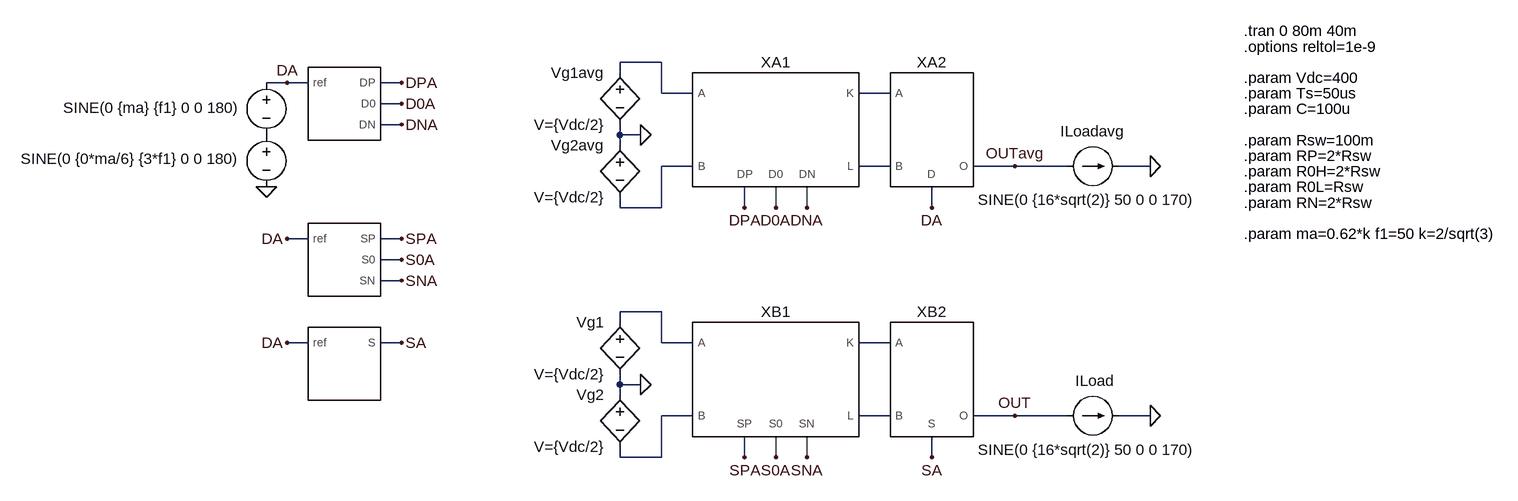
[diagram p0: schematic average_model_validation_4L.asc]
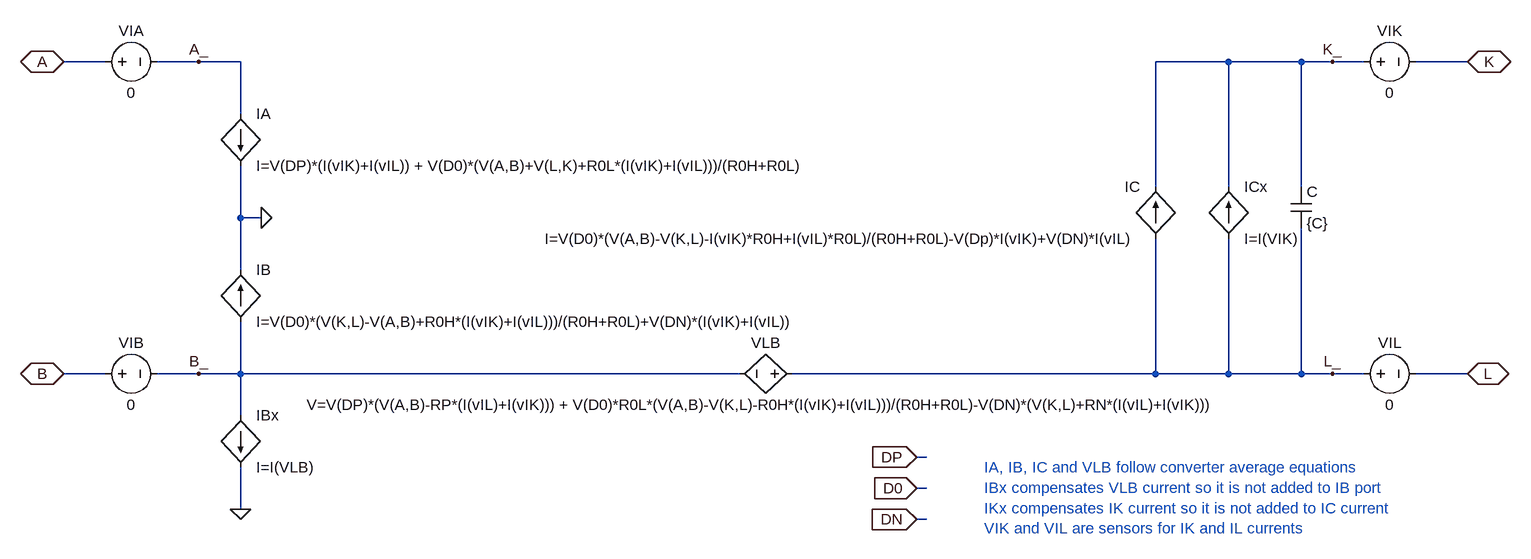
[diagram p1: sub-circuit pn_average_model.asc]
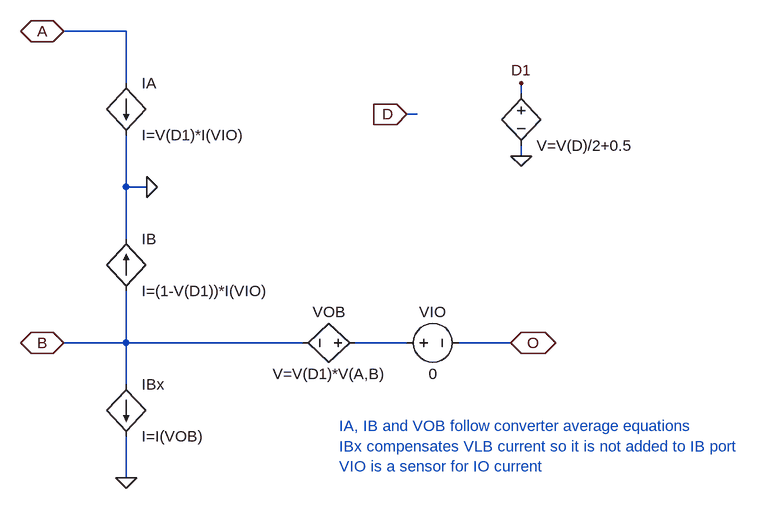
[diagram p2: sub-circuit 2l_average_model.asc]
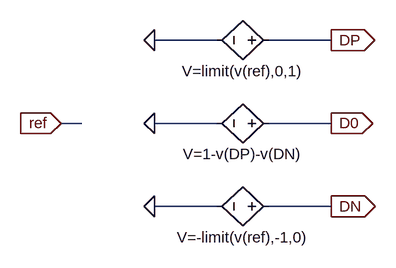
[diagram p3: sub-circuit pn_average_modulator.asc]
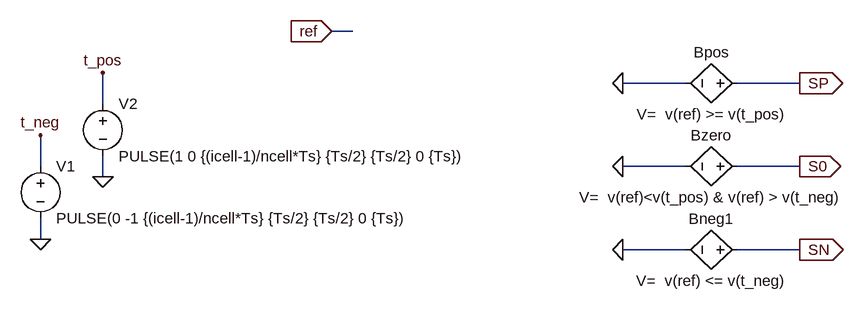
[diagram p4: sub-circuit pn_modulator.asc]
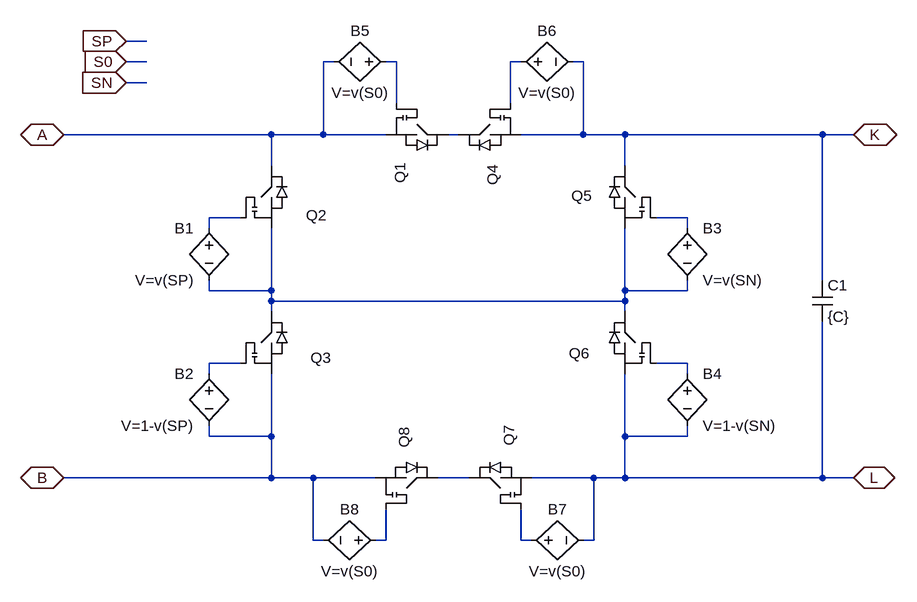
[diagram p5: sub-circuit pn_switching_model.asc]
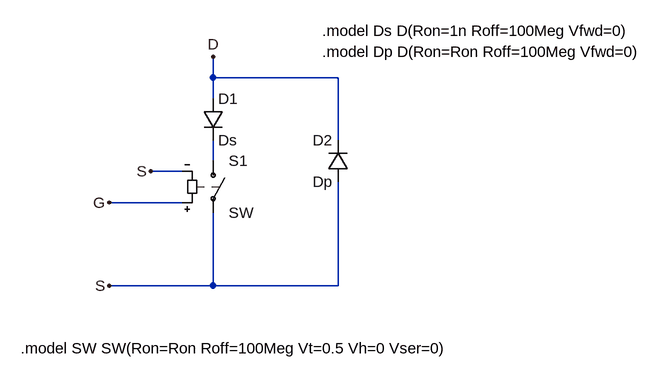
[diagram p6: sub-circuit isw.asc]
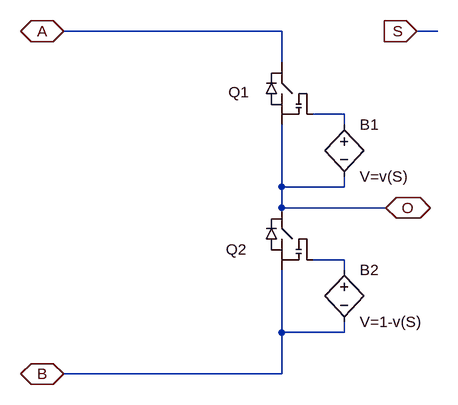
[diagram p7: sub-circuit 2l_switching_model.asc]
average_model_validation_4L.asc, the LTspice schematic file:
Version 4
SHEET 1 4356 1844
WIRE 2224 -1440 2160 -1440
WIRE 2160 -1424 2160 -1440
WIRE 1648 -1408 1616 -1408
WIRE 1680 -1408 1648 -1408
WIRE 1824 -1408 1792 -1408
WIRE 2224 -1392 2224 -1440
WIRE 2272 -1392 2224 -1392
WIRE 2576 -1392 2528 -1392
WIRE 1824 -1376 1792 -1376
WIRE 1824 -1344 1792 -1344
WIRE 2160 -1328 2160 -1344
WIRE 2192 -1328 2160 -1328
WIRE 2160 -1312 2160 -1328
WIRE 2272 -1280 2224 -1280
WIRE 2576 -1280 2528 -1280
WIRE 2768 -1280 2704 -1280
WIRE 2848 -1280 2768 -1280
WIRE 2976 -1280 2928 -1280
WIRE 2160 -1216 2160 -1232
WIRE 2224 -1216 2224 -1280
WIRE 2224 -1216 2160 -1216
WIRE 2352 -1216 2352 -1248
WIRE 2400 -1216 2400 -1248
WIRE 2448 -1216 2448 -1248
WIRE 2640 -1216 2640 -1248
WIRE 1680 -1168 1648 -1168
WIRE 1824 -1168 1792 -1168
WIRE 1824 -1136 1792 -1136
WIRE 1824 -1104 1792 -1104
WIRE 2224 -1056 2160 -1056
WIRE 2160 -1040 2160 -1056
WIRE 1680 -1008 1648 -1008
WIRE 1824 -1008 1792 -1008
WIRE 2224 -1008 2224 -1056
WIRE 2272 -1008 2224 -1008
WIRE 2576 -1008 2528 -1008
WIRE 2160 -944 2160 -960
WIRE 2192 -944 2160 -944
WIRE 2160 -928 2160 -944
WIRE 2272 -896 2224 -896
WIRE 2576 -896 2528 -896
WIRE 2768 -896 2704 -896
WIRE 2848 -896 2768 -896
WIRE 2976 -896 2928 -896
WIRE 2160 -832 2160 -848
WIRE 2224 -832 2224 -896
WIRE 2224 -832 2160 -832
WIRE 2352 -832 2352 -864
WIRE 2400 -832 2400 -864
WIRE 2448 -832 2448 -864
WIRE 2640 -832 2640 -864
FLAG 2976 -896 0
FLAG 1824 -1168 SPA
FLAG 1824 -1136 S0A
FLAG 1824 -1104 SNA
FLAG 2976 -1280 0
FLAG 2352 -1216 DPA
FLAG 2400 -1216 D0A
FLAG 2448 -1216 DNA
FLAG 1824 -1408 DPA
FLAG 1824 -1376 D0A
FLAG 1824 -1344 DNA
FLAG 1616 -1248 0
FLAG 1648 -1408 DA
FLAG 2768 -896 OUT
FLAG 2640 -1216 DA
FLAG 2192 -1328 0
FLAG 1648 -1168 DA
FLAG 2192 -944 0
FLAG 2352 -832 SPA
FLAG 2400 -832 S0A
FLAG 2448 -832 SNA
FLAG 2640 -832 SA
FLAG 2768 -1280 OUTavg
FLAG 1648 -1008 DA
FLAG 1824 -1008 SA
SYMBOL bv 2160 -1440 M0
SYMATTR InstName Vg1avg
SYMATTR Value V={Vdc/2}
SYMBOL PN_average_model 2400 -1344 R0
SYMATTR InstName XA1
SYMATTR SpiceLine C={C} RP={RP} R0H={R0H} R0L={R0L} RN={RN}
SYMBOL voltage 1616 -1424 M0
WINDOW 0 24 16 Invisible 2
WINDOW 3 39 54 Left 2
SYMATTR InstName V1
SYMATTR Value SINE(0 {ma} {f1} 0 0 180)
SYMBOL voltage 1616 -1344 M0
WINDOW 0 24 16 Invisible 2
WINDOW 3 39 53 Left 2
SYMATTR InstName V7
SYMATTR Value SINE(0 {0*ma/6} {3*f1} 0 0 180)
SYMBOL 2L_average_model 2640 -1360 R0
SYMATTR InstName XA2
SYMBOL bv 2160 -1328 M0
SYMATTR InstName Vg2avg
SYMATTR Value V={Vdc/2}
SYMBOL current 2848 -896 M90
WINDOW 123 0 0 Left 2
WINDOW 39 0 0 Left 2
WINDOW 3 52 -137 VRight 2
WINDOW 0 -54 13 VRight 2
SYMATTR Value SINE(0 {16*sqrt(2)} 50 0 0 170)
SYMATTR InstName ILoad
SYMBOL current 2848 -1280 M90
WINDOW 123 0 0 Left 2
WINDOW 39 0 0 Left 2
WINDOW 3 52 -137 VRight 2
WINDOW 0 -54 -10 VRight 2
SYMATTR Value SINE(0 {16*sqrt(2)} 50 0 0 170)
SYMATTR InstName ILoadavg
SYMBOL PN_average_modulator 1728 -1376 R0
WINDOW 0 8 -56 Invisible 2
SYMATTR InstName X2
SYMBOL PN_modulator 1728 -1136 R0
WINDOW 0 8 -56 Invisible 2
SYMATTR InstName X3SP
SYMBOL PN_switching_model 2400 -960 R0
SYMATTR InstName XB1
SYMATTR SpiceLine C=100u Rswitch=Rsw
SYMBOL bv 2160 -1056 M0
SYMATTR InstName Vg1
SYMATTR Value V={Vdc/2}
SYMBOL bv 2160 -944 M0
SYMATTR InstName Vg2
SYMATTR Value V={Vdc/2}
SYMBOL 2L_switching_model 2640 -976 R0
SYMATTR InstName XB2
SYMBOL 2L_modulator 1728 -976 R0
WINDOW 0 8 -56 Invisible 2
SYMATTR InstName X1
TEXT 3120 -1392 Left 2 !.param Ts=50us
TEXT 3120 -1488 Left 2 !.tran 0 80m 40m
TEXT 3120 -1416 Left 2 !.param Vdc=400
TEXT 3120 -1176 Left 2 !.param ma=0.62*k f1=50 k=2/sqrt(3)
TEXT 3120 -1320 Left 2 !.param Rsw=100m
TEXT 3120 -1296 Left 2 !.param RP=2*Rsw
TEXT 3120 -1224 Left 2 !.param RN=2*Rsw
TEXT 3120 -1272 Left 2 !.param R0H=2*Rsw
TEXT 3120 -1248 Left 2 !.param R0L=Rsw
TEXT 3120 -1368 Left 2 !.param C=100u
TEXT 3120 -1464 Left 2 !.options reltol=1e-9

pn_average_model.asc, the sub-circuit schematic file:
Version 4
SHEET 1 2060 780
WIRE -720 16 -784 16
WIRE -576 16 -640 16
WIRE -512 16 -576 16
WIRE 1008 16 896 16
WIRE 1120 16 1008 16
WIRE 1168 16 1120 16
WIRE 1216 16 1168 16
WIRE 1376 16 1296 16
WIRE -512 96 -512 16
WIRE 896 208 896 16
WIRE 1008 208 1008 16
WIRE 1120 208 1120 16
WIRE -512 256 -512 176
WIRE -480 256 -512 256
WIRE -512 336 -512 256
WIRE -720 496 -784 496
WIRE -576 496 -640 496
WIRE -512 496 -512 416
WIRE -512 496 -576 496
WIRE 256 496 -512 496
WIRE 896 496 896 288
WIRE 896 496 336 496
WIRE 1008 496 1008 288
WIRE 1008 496 896 496
WIRE 1120 496 1120 272
WIRE 1120 496 1008 496
WIRE 1168 496 1120 496
WIRE 1216 496 1168 496
WIRE 1376 496 1296 496
WIRE -512 560 -512 496
WIRE 544 624 528 624
WIRE 544 672 528 672
WIRE -512 704 -512 640
WIRE 544 720 528 720
FLAG 1376 16 K
IOPIN 1376 16 BiDir
FLAG 1376 496 L
IOPIN 1376 496 BiDir
FLAG -784 16 A
IOPIN -784 16 BiDir
FLAG -784 496 B
IOPIN -784 496 BiDir
FLAG 528 624 DP
IOPIN 528 624 In
FLAG 528 672 D0
IOPIN 528 672 In
FLAG 528 720 DN
IOPIN 528 720 In
FLAG -480 256 0
FLAG -512 704 0
FLAG -576 16 A_
FLAG -576 496 B_
FLAG 1168 16 K_
FLAG 1168 496 L_
SYMBOL bv 352 496 R90
WINDOW 0 -32 56 VBottom 2
WINDOW 3 32 56 VTop 2
SYMATTR InstName VLB
SYMATTR Value V=V(DP)*(V(A,B)-RP*(I(vIL)+I(vIK))) + V(D0)*R0L*(V(A,B)-V(K,L)-R0H*(I(vIK)+I(vIL)))/(R0H+R0L)-V(DN)*(V(K,L)+RN*(I(vIL)+I(vIK)))
SYMBOL bi -512 96 R0
SYMATTR InstName IA
SYMATTR Value I=V(DP)*(I(vIK)+I(vIL)) + V(D0)*(V(A,B)+V(L,K)+R0L*(I(vIK)+I(vIL)))/(R0H+R0L)
SYMBOL cap 1104 208 R0
SYMATTR InstName C
SYMATTR Value {C}
SYMBOL bi 896 288 R180
WINDOW 0 24 80 Left 2
WINDOW 3 24 0 Left 2
SYMATTR InstName IC
SYMATTR Value I=V(D0)*(V(A,B)-V(K,L)-I(vIK)*R0H+I(vIL)*R0L)/(R0H+R0L)-V(Dp)*I(vIK)+V(DN)*I(vIL)
SYMBOL bi -512 416 M180
WINDOW 0 24 80 Left 2
WINDOW 3 24 0 Left 2
SYMATTR InstName IB
SYMATTR Value I=V(D0)*(V(K,L)-V(A,B)+R0H*(I(vIK)+I(vIL)))/(R0H+R0L)+V(DN)*(I(vIK)+I(vIL))
SYMBOL voltage 1200 496 R270
WINDOW 0 32 56 VTop 2
WINDOW 3 -32 56 VBottom 2
SYMATTR InstName VIL
SYMATTR Value 0
SYMBOL voltage 1200 16 R270
WINDOW 0 32 56 VTop 2
WINDOW 3 -32 56 VBottom 2
SYMATTR InstName VIK
SYMATTR Value 0
SYMBOL bi -512 560 R0
SYMATTR InstName IBx
SYMATTR Value I=I(VLB)
SYMBOL bi 1008 288 M180
WINDOW 0 24 80 Left 2
WINDOW 3 24 0 Left 2
SYMATTR InstName ICx
SYMATTR Value I=I(VIK)
SYMBOL voltage -736 496 R270
WINDOW 0 32 56 VTop 2
WINDOW 3 -32 56 VBottom 2
SYMATTR InstName VIB
SYMATTR Value 0
SYMBOL voltage -736 16 R270
WINDOW 0 32 56 VTop 2
WINDOW 3 -32 56 VBottom 2
SYMATTR InstName VIA
SYMATTR Value 0
TEXT 632 640 Left 2 ;IA, IB, IC and VLB follow converter average equations\nIBx compensates VLB current so it is not added to IB port\nIKx compensates IK current so it is not added to IC current\nVIK and VIL are sensors for IK and IL currents

2l_average_model.asc, the sub-circuit schematic file:
Version 4
SHEET 1 2060 780
WIRE -512 16 -608 16
WIRE -512 96 -512 16
WIRE 96 112 96 96
WIRE -64 144 -80 144
WIRE 96 208 96 192
WIRE -512 256 -512 176
WIRE -480 256 -512 256
WIRE -512 336 -512 256
WIRE -512 496 -512 416
WIRE -512 496 -608 496
WIRE -240 496 -512 496
WIRE -80 496 -160 496
WIRE 80 496 0 496
WIRE -512 560 -512 496
WIRE -512 704 -512 640
FLAG 80 496 O
IOPIN 80 496 BiDir
FLAG -608 16 A
IOPIN -608 16 BiDir
FLAG -608 496 B
IOPIN -608 496 BiDir
FLAG -80 144 D
IOPIN -80 144 In
FLAG -480 256 0
FLAG -512 704 0
FLAG 96 208 0
FLAG 96 96 D1
SYMBOL bv -144 496 R90
WINDOW 0 -32 56 VBottom 2
WINDOW 3 32 56 VTop 2
SYMATTR InstName VOB
SYMATTR Value V=V(D1)*V(A,B)
SYMBOL bi -512 96 R0
SYMATTR InstName IA
SYMATTR Value I=V(D1)*I(VIO)
SYMBOL bi -512 416 M180
WINDOW 0 24 80 Left 2
WINDOW 3 24 0 Left 2
SYMATTR InstName IB
SYMATTR Value I=(1-V(D1))*I(VIO)
SYMBOL voltage -96 496 R270
WINDOW 0 32 56 VTop 2
WINDOW 3 -32 56 VBottom 2
SYMATTR InstName VIO
SYMATTR Value 0
SYMBOL bi -512 560 R0
SYMATTR InstName IBx
SYMATTR Value I=I(VOB)
SYMBOL bv 96 96 R0
WINDOW 0 24 16 Invisible 2
SYMATTR InstName VD
SYMATTR Value V=V(D)/2+0.5
TEXT -184 624 Left 2 ;IA, IB and VOB follow converter average equations\nIBx compensates VLB current so it is not added to IB port\nVIO is a sensor for IO current

pn_average_modulator.asc, the sub-circuit schematic file:
Version 4
SHEET 1 880 680
WIRE 304 160 208 160
WIRE 480 160 384 160
WIRE 96 288 64 288
WIRE 304 288 208 288
WIRE 480 288 384 288
WIRE 304 416 208 416
WIRE 480 416 384 416
FLAG 208 160 0
FLAG 208 288 0
FLAG 208 416 0
FLAG 480 160 DP
IOPIN 480 160 Out
FLAG 480 288 D0
IOPIN 480 288 Out
FLAG 480 416 DN
IOPIN 480 416 Out
FLAG 64 288 ref
IOPIN 64 288 In
SYMBOL bv 400 160 R90
WINDOW 0 -32 56 Invisible 2
WINDOW 3 32 56 VTop 2
SYMATTR InstName Bpos1
SYMATTR Value V=limit(v(ref),0,1)
SYMBOL bv 400 288 R90
WINDOW 0 -32 56 Invisible 2
WINDOW 3 32 56 VTop 2
SYMATTR InstName Bzero1
SYMATTR Value V=1-v(DP)-v(DN)
SYMBOL bv 400 416 R90
WINDOW 0 -32 56 Invisible 2
WINDOW 3 32 56 VTop 2
SYMATTR InstName Bneg1
SYMATTR Value V=-limit(v(ref),-1,0)

pn_modulator.asc, the sub-circuit schematic file:
Version 4
SHEET 1 1100 680
WIRE 304 160 272 160
WIRE 816 240 720 240
WIRE 992 240 896 240
WIRE -80 272 -80 224
WIRE -176 368 -176 320
WIRE 816 368 720 368
WIRE 992 368 896 368
WIRE -80 384 -80 352
WIRE -176 480 -176 448
WIRE 816 496 720 496
WIRE 992 496 896 496
FLAG -176 480 0
FLAG -176 320 t_neg
FLAG -80 384 0
FLAG -80 224 t_pos
FLAG 720 240 0
FLAG 720 368 0
FLAG 720 496 0
FLAG 992 240 SP
IOPIN 992 240 Out
FLAG 992 368 S0
IOPIN 992 368 Out
FLAG 992 496 SN
IOPIN 992 496 Out
FLAG 272 160 ref
IOPIN 272 160 In
SYMBOL voltage -176 352 R0
WINDOW 123 0 0 Left 2
WINDOW 39 0 0 Left 2
SYMATTR InstName V1
SYMATTR Value PULSE(0 -1 {(icell-1)/ncell*Ts} {Ts/2} {Ts/2} 0 {Ts})
SYMBOL voltage -80 256 R0
WINDOW 123 0 0 Left 2
WINDOW 39 0 0 Left 2
SYMATTR InstName V2
SYMATTR Value PULSE(1 0 {(icell-1)/ncell*Ts} {Ts/2} {Ts/2} 0 {Ts})
SYMBOL bv 912 240 R90
WINDOW 0 -32 56 VBottom 2
WINDOW 3 32 56 VTop 2
SYMATTR InstName Bpos
SYMATTR Value V=  v(ref) >= v(t_pos)
SYMBOL bv 912 368 R90
WINDOW 0 -32 56 VBottom 2
WINDOW 3 32 56 VTop 2
SYMATTR InstName Bzero
SYMATTR Value V=  v(ref)<v(t_pos) & v(ref) > v(t_neg)
SYMBOL bv 912 496 R90
WINDOW 0 -32 56 VBottom 2
WINDOW 3 32 56 VTop 2
SYMATTR InstName Bneg1
SYMATTR Value V=  v(ref) <= v(t_neg)

pn_switching_model.asc, the sub-circuit schematic file:
Version 4
SHEET 1 1104 712
WIRE -48 -112 -80 -112
WIRE -48 -80 -80 -80
WIRE 240 -80 224 -80
WIRE 336 -80 320 -80
WIRE 528 -80 512 -80
WIRE 624 -80 608 -80
WIRE -48 -48 -80 -48
WIRE 336 -16 336 -80
WIRE 512 -16 512 -80
WIRE 144 32 -176 32
WIRE 224 32 224 -80
WIRE 224 32 144 32
WIRE 320 32 224 32
WIRE 432 32 416 32
WIRE 624 32 624 -80
WIRE 624 32 528 32
WIRE 688 32 624 32
WIRE 992 32 688 32
WIRE 1040 32 992 32
WIRE 144 80 144 32
WIRE 688 80 688 32
WIRE 96 160 48 160
WIRE 784 160 736 160
WIRE 48 176 48 160
WIRE 784 176 784 160
WIRE 992 256 992 32
WIRE 48 272 48 256
WIRE 144 272 144 176
WIRE 144 272 48 272
WIRE 688 272 688 176
WIRE 784 272 784 256
WIRE 784 272 688 272
WIRE 144 288 144 272
WIRE 688 288 688 272
WIRE 688 288 144 288
WIRE 144 304 144 288
WIRE 688 304 688 288
WIRE 96 384 48 384
WIRE 784 384 736 384
WIRE 48 400 48 384
WIRE 784 400 784 384
WIRE 48 496 48 480
WIRE 144 496 144 400
WIRE 144 496 48 496
WIRE 688 496 688 400
WIRE 784 496 784 480
WIRE 784 496 688 496
WIRE 144 560 144 496
WIRE 144 560 -176 560
WIRE 208 560 144 560
WIRE 304 560 208 560
WIRE 448 560 400 560
WIRE 640 560 544 560
WIRE 688 560 688 496
WIRE 688 560 640 560
WIRE 992 560 992 320
WIRE 992 560 688 560
WIRE 1040 560 992 560
WIRE 208 656 208 560
WIRE 224 656 208 656
WIRE 320 656 320 608
WIRE 320 656 304 656
WIRE 528 656 528 608
WIRE 544 656 528 656
WIRE 640 656 640 560
WIRE 640 656 624 656
FLAG 1040 32 K
IOPIN 1040 32 BiDir
FLAG 1040 560 L
IOPIN 1040 560 BiDir
FLAG -176 32 A
IOPIN -176 32 BiDir
FLAG -176 560 B
IOPIN -176 560 BiDir
FLAG -80 -112 SP
IOPIN -80 -112 In
FLAG -80 -80 S0
IOPIN -80 -80 In
FLAG -80 -48 SN
IOPIN -80 -48 In
SYMBOL bv 48 160 M0
SYMATTR InstName B1
SYMATTR Value V=v(SP)
SYMBOL bv 48 384 M0
SYMATTR InstName B2
SYMATTR Value V=1-v(SP)
SYMBOL bv 784 160 R0
SYMATTR InstName B3
SYMATTR Value V=v(SN)
SYMBOL bv 784 384 R0
SYMATTR InstName B4
SYMATTR Value V=1-v(SN)
SYMBOL bv 336 -80 R90
WINDOW 0 -32 56 VBottom 2
WINDOW 3 32 56 VTop 2
SYMATTR InstName B5
SYMATTR Value V=v(S0)
SYMBOL bv 512 -80 M90
WINDOW 0 -32 56 VBottom 2
WINDOW 3 32 56 VTop 2
SYMATTR InstName B6
SYMATTR Value V=v(S0)
SYMBOL iSW 352 32 R90
WINDOW 0 43 10 Left 2
SYMATTR InstName Q1
SYMATTR SpiceLine Ron=Rswitch
SYMBOL iSW 144 144 R0
WINDOW 0 53 12 Left 2
SYMATTR InstName Q2
SYMATTR SpiceLine Ron=Rswitch
SYMBOL iSW 144 368 R0
WINDOW 0 60 7 Left 2
SYMATTR InstName Q3
SYMATTR SpiceLine Ron=Rswitch
SYMBOL iSW 496 32 M90
WINDOW 0 46 -12 Left 2
SYMATTR InstName Q4
SYMATTR SpiceLine Ron=Rswitch
SYMBOL iSW 688 144 M0
WINDOW 0 50 -18 Left 2
SYMATTR InstName Q5
SYMATTR SpiceLine Ron=Rswitch
SYMBOL iSW 688 368 M0
WINDOW 0 54 0 Left 2
SYMATTR InstName Q6
SYMATTR SpiceLine Ron=Rswitch
SYMBOL cap 976 256 R0
SYMATTR InstName C1
SYMATTR Value {C}
SYMBOL bv 528 656 R270
WINDOW 0 32 56 VTop 2
WINDOW 3 -32 56 VBottom 2
SYMATTR InstName B7
SYMATTR Value V=v(S0)
SYMBOL bv 320 656 M270
WINDOW 0 32 56 VTop 2
WINDOW 3 -32 56 VBottom 2
SYMATTR InstName B8
SYMATTR Value V=v(S0)
SYMBOL iSW 512 560 R270
WINDOW 0 49 -2 Left 2
SYMATTR InstName Q7
SYMATTR SpiceLine Ron=Rswitch
SYMBOL iSW 336 560 M270
WINDOW 0 46 -12 Left 2
SYMATTR InstName Q8
SYMATTR SpiceLine Ron=Rswitch

isw.asc, the sub-circuit schematic file:
Version 4
SHEET 1 880 680
WIRE 160 -32 160 -64
WIRE 352 -32 160 -32
WIRE 160 0 160 -32
WIRE 352 64 352 -32
WIRE 160 96 160 64
WIRE 112 112 64 112
WIRE 112 160 0 160
WIRE 160 288 0 288
WIRE 160 288 160 176
WIRE 352 288 352 128
WIRE 352 288 160 288
FLAG 0 160 G
FLAG 0 288 S
FLAG 160 -64 D
FLAG 64 112 S
SYMBOL sw 160 80 R0
SYMATTR InstName S1
SYMBOL diode 144 0 R0
SYMATTR InstName D1
SYMATTR Value Ds
SYMBOL diode 368 128 R180
WINDOW 0 24 64 Left 2
WINDOW 3 24 0 Left 2
SYMATTR InstName D2
SYMATTR Value Dp
TEXT -136 384 Left 2 !.model SW SW(Ron=Ron Roff=100Meg Vt=0.5 Vh=0 Vser=0)
TEXT 328 -104 Left 2 !.model Ds D(Ron=1n Roff=100Meg Vfwd=0)
TEXT 328 -72 Left 2 !.model Dp D(Ron=Ron Roff=100Meg Vfwd=0)

2l_switching_model.asc, the sub-circuit schematic file:
Version 4
SHEET 1 880 680
WIRE 448 96 112 96
WIRE 688 96 656 96
WIRE 448 144 448 96
WIRE 544 224 496 224
WIRE 544 240 544 224
WIRE 448 336 448 240
WIRE 544 336 544 320
WIRE 544 336 448 336
WIRE 448 368 448 336
WIRE 608 368 448 368
WIRE 544 448 496 448
WIRE 544 464 544 448
WIRE 448 560 448 464
WIRE 544 560 544 544
WIRE 544 560 448 560
WIRE 448 624 448 560
WIRE 448 624 112 624
FLAG 608 368 O
IOPIN 608 368 BiDir
FLAG 112 96 A
IOPIN 112 96 BiDir
FLAG 112 624 B
IOPIN 112 624 BiDir
FLAG 656 96 S
IOPIN 656 96 In
SYMBOL bv 544 224 R0
SYMATTR InstName B1
SYMATTR Value V=v(S)
SYMBOL bv 544 448 R0
SYMATTR InstName B2
SYMATTR Value V=1-v(S)
SYMBOL iSW 448 208 M0
WINDOW 0 50 -18 Left 2
SYMATTR InstName Q1
SYMATTR SpiceLine Ron=Rsw
SYMBOL iSW 448 432 M0
WINDOW 0 54 0 Left 2
SYMATTR InstName Q2
SYMATTR SpiceLine Ron=Rsw

2l_modulator.asc, the sub-circuit schematic file:
Version 4
SHEET 1 880 680
WIRE -96 208 -128 208
WIRE 336 208 240 208
WIRE 512 208 416 208
WIRE 80 336 80 288
WIRE 80 448 80 416
FLAG 80 448 0
FLAG 80 288 t_posneg
FLAG 240 208 0
FLAG 512 208 S
IOPIN 512 208 Out
FLAG -128 208 ref
IOPIN -128 208 In
SYMBOL voltage 80 320 R0
WINDOW 123 0 0 Left 2
WINDOW 39 0 0 Left 2
SYMATTR InstName V1
SYMATTR Value PULSE(1 -1 {0.5*Ts} {Ts/2} {Ts/2} 0 {Ts})
SYMBOL bv 432 208 R90
WINDOW 0 -32 56 VBottom 2
WINDOW 3 32 56 VTop 2
SYMATTR InstName Bpos1
SYMATTR Value V=  v(ref) >= v(t_posneg)

The netlist it stands for:
* average_model_validation_4L.asc
B§Vg1avg N001 0 V={Vdc/2}
XXA1 D0A DNA DPA N001 N003 N002 N004 pn_average_model params: C={C} RP={RP} R0H={R0H} R0L={R0L} RN={RN}
V1 DA P001 SINE(0 {ma} {f1} 0 0 180)
V7 P001 0 SINE(0 {0*ma/6} {3*f1} 0 0 180)
XXA2 DA N002 N004 OUTavg 2l_average_model
B§Vg2avg 0 N003 V={Vdc/2}
ILoad OUT 0 SINE(0 {16*sqrt(2)} 50 0 0 170)
ILoadavg OUTavg 0 SINE(0 {16*sqrt(2)} 50 0 0 170)
XX2 DA D0A DNA DPA pn_average_modulator
XX3SP DA S0A SNA SPA pn_modulator params: Ts = {Ts} iCell=1 nCell=1
XXB1 S0A SNA SPA N005 N007 N006 N008 pn_switching_model params: C=100u Rswitch=Rsw
B§Vg1 N005 0 V={Vdc/2}
B§Vg2 0 N007 V={Vdc/2}
XXB2 SA N006 N008 OUT 2l_switching_model
XX1 DA SA 2l_modulator params: Ts = {Ts}

* block symbol definitions
.subckt pn_average_model D0 DN DP A B K L
B§VLB L_ B_ V=V(DP)*(V(A,B)-RP*(I(vIL)+I(vIK))) + V(D0)*R0L*(V(A,B)-V(K,L)-R0H*(I(vIK)+I(vIL)))/(R0H+R0L)-V(DN)*(V(K,L)+RN*(I(vIL)+I(vIK)))
B§IA A_ 0 I=V(DP)*(I(vIK)+I(vIL)) + V(D0)*(V(A,B)+V(L,K)+R0L*(I(vIK)+I(vIL)))/(R0H+R0L)
C K_ L_ {C}
B§IC L_ K_ I=V(D0)*(V(A,B)-V(K,L)-I(vIK)*R0H+I(vIL)*R0L)/(R0H+R0L)-V(Dp)*I(vIK)+V(DN)*I(vIL)
B§IB B_ 0 I=V(D0)*(V(K,L)-V(A,B)+R0H*(I(vIK)+I(vIL)))/(R0H+R0L)+V(DN)*(I(vIK)+I(vIL))
VIL L_ L 0
VIK K_ K 0
B§IBx B_ 0 I=I(VLB)
B§ICx L_ K_ I=I(VIK)
VIB B B_ 0
VIA A A_ 0
* IA, IB, IC and VLB follow converter average equations
* IBx compensates VLB current so it is not added to IB port
* IKx compensates IK current so it is not added to IC current
* VIK and VIL are sensors for IK and IL currents
.ends pn_average_model

.subckt 2l_average_model D A B O
B§VOB N001 B V=V(D1)*V(A,B)
B§IA A 0 I=V(D1)*I(VIO)
B§IB B 0 I=(1-V(D1))*I(VIO)
VIO N001 O 0
B§IBx B 0 I=I(VOB)
B§VD D1 0 V=V(D)/2+0.5
* IA, IB and VOB follow converter average equations
* IBx compensates VLB current so it is not added to IB port
* VIO is a sensor for IO current
.ends 2l_average_model

.subckt pn_average_modulator ref D0 DN DP
Bpos1 DP 0 V=limit(v(ref),0,1)
Bzero1 D0 0 V=1-v(DP)-v(DN)
Bneg1 DN 0 V=-limit(v(ref),-1,0)
.ends pn_average_modulator

.subckt pn_modulator ref S0 SN SP
V1 t_neg 0 PULSE(0 -1 {(icell-1)/ncell*Ts} {Ts/2} {Ts/2} 0 {Ts})
V2 t_pos 0 PULSE(1 0 {(icell-1)/ncell*Ts} {Ts/2} {Ts/2} 0 {Ts})
Bpos SP 0 V=  v(ref) >= v(t_pos)
Bzero S0 0 V=  v(ref)<v(t_pos) & v(ref) > v(t_neg)
Bneg1 SN 0 V=  v(ref) <= v(t_neg)
.ends pn_modulator

.subckt pn_switching_model S0 SN SP A B K L
B1 N004 N006 V=v(SP)
B2 N007 B V=1-v(SP)
B3 N005 N006 V=v(SN)
B4 N008 L V=1-v(SN)
B5 N001 A V=v(S0)
B6 N002 K V=v(S0)
XQ1 N003 A N001 isw params: Ron=Rswitch
XQ2 A N006 N004 isw params: Ron=Rswitch
XQ3 N006 B N007 isw params: Ron=Rswitch
XQ4 N003 K N002 isw params: Ron=Rswitch
XQ5 K N006 N005 isw params: Ron=Rswitch
XQ6 N006 L N008 isw params: Ron=Rswitch
C1 K L {C}
B7 N011 L V=v(S0)
B8 N010 B V=v(S0)
XQ7 N009 L N011 isw params: Ron=Rswitch
XQ8 N009 B N010 isw params: Ron=Rswitch
.ends pn_switching_model

.subckt isw D S G
S1 N001 S G S SW
D1 D N001 Ds
D2 S D Dp
.model SW SW(Ron=Ron Roff=100Meg Vt=0.5 Vh=0 Vser=0)
.model Ds D(Ron=1n Roff=100Meg Vfwd=0)
.model Dp D(Ron=Ron Roff=100Meg Vfwd=0)
.ends isw

.subckt 2l_switching_model S A B O
B1 N001 O V=v(S)
B2 N002 B V=1-v(S)
XQ1 A O N001 isw params: Ron=Rsw
XQ2 O B N002 isw params: Ron=Rsw
.ends 2l_switching_model

.subckt 2l_modulator ref S
V1 t_posneg 0 PULSE(1 -1 {0.5*Ts} {Ts/2} {Ts/2} 0 {Ts})
Bpos1 S 0 V=  v(ref) >= v(t_posneg)
.ends 2l_modulator

.model D D
.lib standard.dio
.param Ts=50us
.tran 0 80m 40m
.param Vdc=400
.param ma=0.62*k f1=50 k=2/sqrt(3)
.param Rsw=100m
.param RP=2*Rsw
.param RN=2*Rsw
.param R0H=2*Rsw
.param R0L=Rsw
.param C=100u
.options reltol=1e-9
.backanno
.end